# EAGLE schematic NixieClock_2_1 (EAGLE 9.2.2)
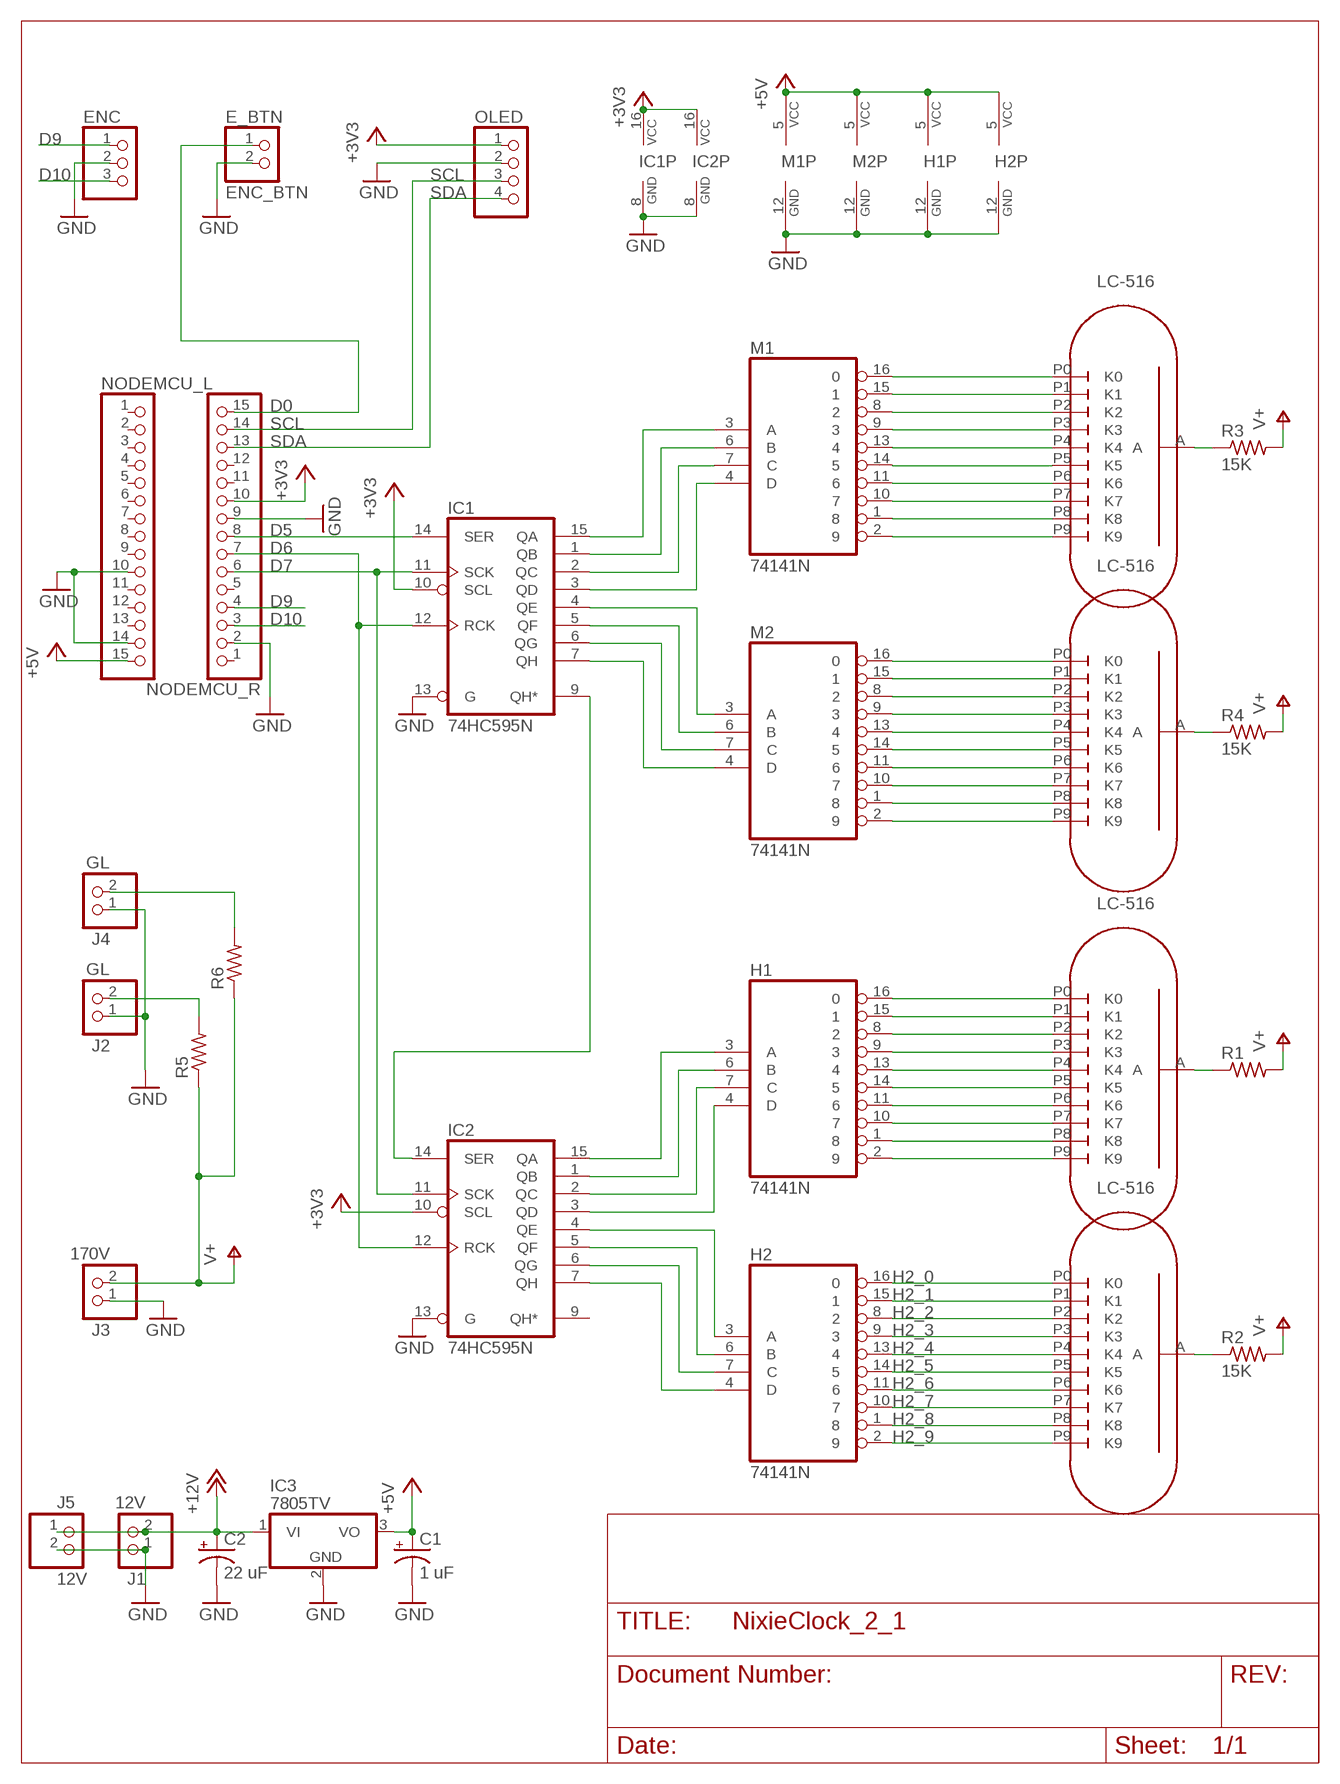
[diagram p0: schematic, sheet 1]

## Parts
C1  1 uF  CPOL-USTT2D5  [TT2D5]
C2  22 uF  CPOL-USTT2D5  [TT2D5]
E_BTN  ENC_BTN  PINHD-1X2  [1X02]
ENC  PINHD-1X3  [1X03]
H1  74141N  [DIL16]
H2  74141N  [DIL16]
IC1  74HC595N  [DIL16]
IC2  74HC595N  [DIL16]
IC3  7805TV  [TO220V]
J1  12V  PINHD-1X2  [1X02]
J2  GL  PINHD-1X2  [1X02]
J3  170V  PINHD-1X2  [1X02]
J4  GL  PINHD-1X2  [1X02]
J5  12V  PINHD-1X2  [1X02]
M1  74141N  [DIL16]
M2  74141N  [DIL16]
NODEMCU_L  PINHD-1X15  [1X15]
NODEMCU_R  PINHD-1X15  [1X15]
OLED  PINHD-1X4  [1X04]
R1  15K  R-US_0207/10  [0207/10]
R2  15K  R-US_0207/10  [0207/10]
R3  15K  R-US_0207/10  [0207/10]
R4  15K  R-US_0207/10  [0207/10]
R5  100k  R-US_0207/10  [0207/10]
R6  100k  R-US_0207/10  [0207/10]
U$1M2  LC-516  [LC-516]
U$2M1  LC-516  [LC-516]
U$3H2  LC-516  [LC-516]
U$4H1  LC-516  [LC-516]

## Nets
+3V3: IC1.10(SCL) IC1.16(VCC) IC2.10(SCL) IC2.16(VCC) NODEMCU_R.10 OLED.1
+5V: C1.+ H1.5(VCC) H2.5(VCC) IC3.3(VO) M1.5(VCC) M2.5(VCC) NODEMCU_L.15
+12V: C2.+ IC3.1(VI) J1.2 J5.1
D0: E_BTN.1 NODEMCU_R.15
D5: IC1.14(SER) NODEMCU_R.8
D6: IC1.12(RCK) IC2.12(RCK) NODEMCU_R.7
D7: IC1.11(SCK) IC2.11(SCK) NODEMCU_R.6
D9: ENC.1 NODEMCU_R.4
D10: ENC.3 NODEMCU_R.3
GND: C1.- C2.- E_BTN.2 ENC.2 H1.12(GND) H2.12(GND) IC1.8(GND) IC1.13(G) IC2.8(GND) IC2.13(G) IC3.2(GND) J1.1 J2.1 J3.1 J4.1 J5.2 M1.12(GND) M2.12(GND) NODEMCU_L.10 NODEMCU_L.14 NODEMCU_R.2 NODEMCU_R.9 OLED.2
H2_0: H2.16 U$4H1.P0(K0)
H2_1: H2.15 U$4H1.P1(K1)
H2_2: H2.8 U$4H1.P2(K2)
H2_3: H2.9 U$4H1.P3(K3)
H2_4: H2.13 U$4H1.P4(K4)
H2_5: H2.14 U$4H1.P5(K5)
H2_6: H2.11 U$4H1.P6(K6)
H2_7: H2.10 U$4H1.P7(K7)
H2_8: H2.1 U$4H1.P8(K8)
H2_9: H2.2 U$4H1.P9(K9)
N$1: H1.16 U$3H2.P0(K0)
N$2: H1.2 U$3H2.P9(K9)
N$3: H1.9 U$3H2.P3(K3)
N$4: H1.13 U$3H2.P4(K4)
N$5: H1.14 U$3H2.P5(K5)
N$6: H1.11 U$3H2.P6(K6)
N$7: H1.10 U$3H2.P7(K7)
N$8: H1.1 U$3H2.P8(K8)
N$9: H1.8 U$3H2.P2(K2)
N$10: H1.15 U$3H2.P1(K1)
N$11: R1.1 U$3H2.A
N$12: J4.2 R6.2
N$13: J2.2 R5.2
N$22: R2.1 U$4H1.A
N$23: M1.16 U$1M2.P0(K0)
N$24: M1.9 U$1M2.P3(K3)
N$25: M1.13 U$1M2.P4(K4)
N$26: M1.14 U$1M2.P5(K5)
N$27: M1.11 U$1M2.P6(K6)
N$28: M1.10 U$1M2.P7(K7)
N$29: M1.1 U$1M2.P8(K8)
N$30: M1.2 U$1M2.P9(K9)
N$31: M1.8 U$1M2.P2(K2)
N$32: M1.15 U$1M2.P1(K1)
N$33: R3.1 U$1M2.A
N$34: M2.16 U$2M1.P0(K0)
N$35: M2.9 U$2M1.P3(K3)
N$36: M2.13 U$2M1.P4(K4)
N$37: M2.14 U$2M1.P5(K5)
N$38: M2.11 U$2M1.P6(K6)
N$39: M2.10 U$2M1.P7(K7)
N$40: M2.1 U$2M1.P8(K8)
N$41: M2.2 U$2M1.P9(K9)
N$42: M2.8 U$2M1.P2(K2)
N$43: M2.15 U$2M1.P1(K1)
N$44: R4.1 U$2M1.A
N$45: IC1.15(QA) M1.3(A)
N$46: IC1.1(QB) M1.6(B)
N$47: IC1.2(QC) M1.7(C)
N$48: IC1.3(QD) M1.4(D)
N$49: IC1.4(QE) M2.3(A)
N$50: IC1.5(QF) M2.6(B)
N$51: IC1.6(QG) M2.7(C)
N$52: IC1.7(QH) M2.4(D)
N$53: H1.3(A) IC2.15(QA)
N$54: H1.6(B) IC2.1(QB)
N$55: H1.7(C) IC2.2(QC)
N$56: H1.4(D) IC2.3(QD)
N$57: H2.3(A) IC2.4(QE)
N$58: H2.6(B) IC2.5(QF)
N$59: H2.7(C) IC2.6(QG)
N$60: H2.4(D) IC2.7(QH)
N$61: IC1.9(QH*) IC2.14(SER)
SCL: NODEMCU_R.14 OLED.3
SDA: NODEMCU_R.13 OLED.4
V+: J3.2 R1.2 R2.2 R3.2 R4.2 R5.1 R6.1
Unconnected: IC2.9(QH*) NODEMCU_L.1 NODEMCU_L.2 NODEMCU_L.3 NODEMCU_L.4 NODEMCU_L.5 NODEMCU_L.6 NODEMCU_L.7 NODEMCU_L.8 NODEMCU_L.9 NODEMCU_L.11 NODEMCU_L.12 NODEMCU_L.13 NODEMCU_R.1 NODEMCU_R.5 NODEMCU_R.11 NODEMCU_R.12

## Library data of the parts
C1 C2 = rcl:CPOL-US: POLARIZED CAPACITOR, American symbol; SPICEPREFIX: C
E_BTN J1-J5 = pinhead:PINHD-1X2: PIN HEADER
ENC = pinhead:PINHD-1X3: PIN HEADER
H1 H2 M1 M2 = 74xx-us:74*141: BCD to decimal DECODER/DRIVER
IC1 IC2 = 74xx-eu:74*595: 8-bit SHIFT REGISTER, output latch
IC3 = linear:78*: Positive VOLTAGE REGULATOR Source: http://cache.national.com/ds/LM/LM78L05.pdf http://www.fairchildsemi.com/ds/LM/LM7805.pdf
NODEMCU_L NODEMCU_R = pinhead:PINHD-1X15: PIN HEADER
OLED = pinhead:PINHD-1X4: PIN HEADER
R1-R6 = resistor:R-US_: RESISTOR, American symbol
U$1M2 U$2M1 U$3H2 U$4H1 = LC-516:LC-516: Nixie Tube LC-516